# EAGLE schematic Manipulator_loads (EAGLE 9.4.2)

## Sheet 1 of 2
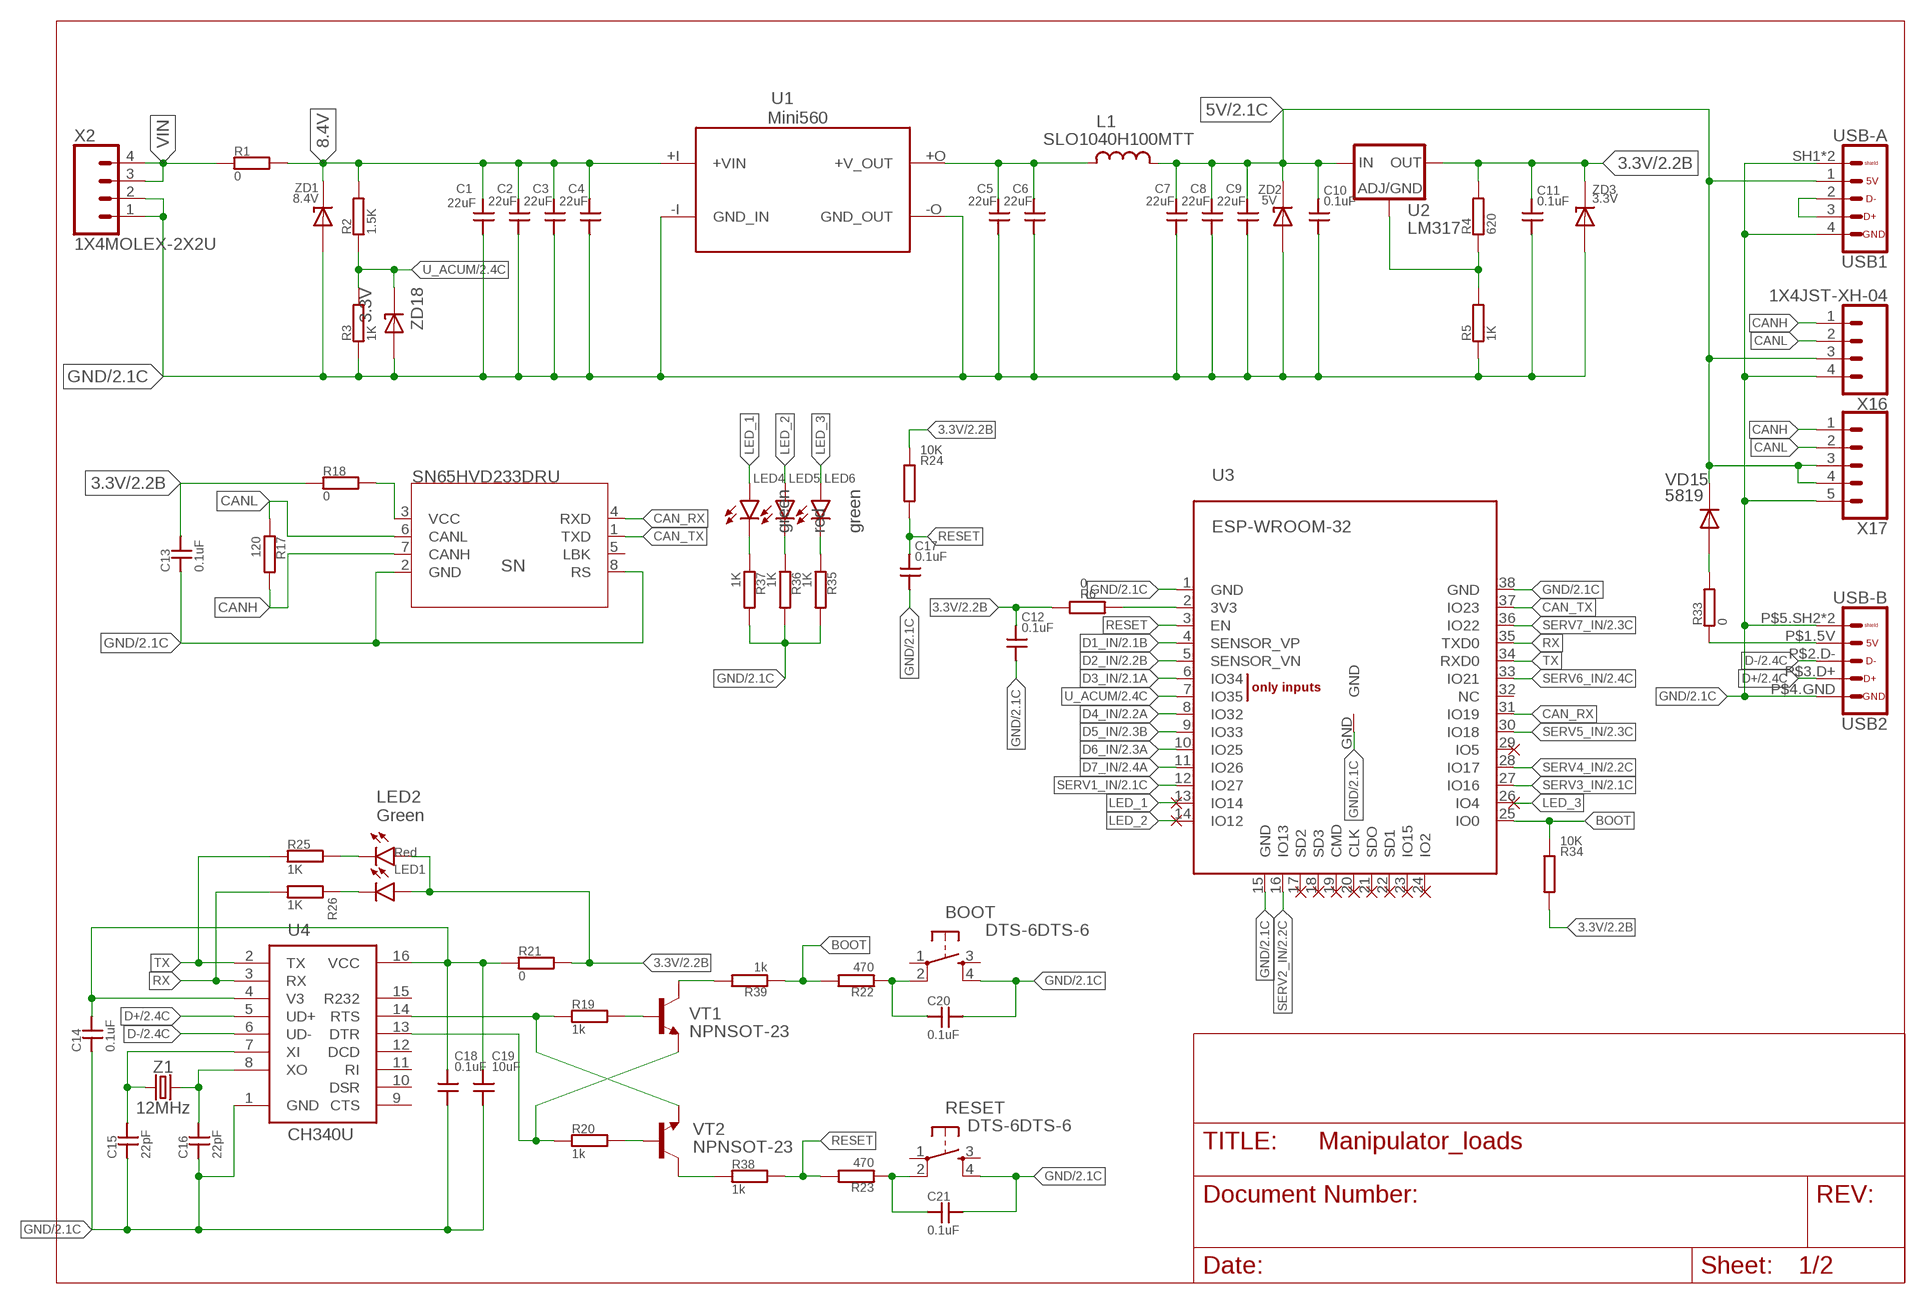
[diagram p0: schematic, sheet 1]

### Parts
BOOT  DTS-6DTS-6  [DTS-6]
C1  22uF  C1206  [1206]
C2  22uF  C1206  [1206]
C3  22uF  C1206  [1206]
C4  22uF  C1206  [1206]
C5  22uF  C1206  [1206]
C6  22uF  C1206  [1206]
C7  22uF  C1206  [1206]
C8  22uF  C1206  [1206]
C9  22uF  C1206  [1206]
C10  0.1uF  C0603  [0603]
C11  0.1uF  C0603  [0603]
C12  0.1uF  C0603  [0603]
C13  0.1uF  C0603  [0603]
C14  0.1uF  C0603  [0603]
C15  22pF  C0603  [0603]
C16  22pF  C0603  [0603]
C17  0.1uF  C0603  [0603]
C18  0.1uF  C0603  [0603]
C19  10uF  C0603  [0603]
C20  0.1uF  C0603  [0603]
C21  0.1uF  C0603  [0603]
L1  SLO1040H100MTT  INDUCTOR108100X400  [108100X400]
LED1  Red  LED1608  [1608]
LED2  Green  LED1608  [1608]
LED4  green  LED1608  [1608]
LED5  red  LED1608  [1608]
LED6  green  LED1608  [1608]
R1  0  R2512  [2512]
R2  1.5K  R0603  [0603]
R3  1K  R0603  [0603]
R4  620  R0603  [0603]
R5  1K  R0603  [0603]
R6  0  R0603  [0603]
R17  120  R0603  [0603]
R18  0  R0603  [0603]
R19  1k  R0603  [0603]
R20  1k  R0603  [0603]
R21  0  R0603  [0603]
R22  470  R0603  [0603]
R23  470  R0603  [0603]
R24  10K  R0603  [0603]
R25  1K  R0603  [0603]
R26  1K  R0603  [0603]
R33  0  R0603  [0603]
R34  10K  R0603  [0603]
R35  1K  R0603  [0603]
R36  1K  R0603  [0603]
R37  1K  R0603  [0603]
R38  1k  R0603  [0603]
R39  1k  R0603  [0603]
RESET  DTS-6DTS-6  [DTS-6]
SN  SN65HVD233DRU  [SOIC-8]
U1  Mini560  MINI560  [MINI560_OTB]
U2  LM317  [D-PAK]
U3  ESP-WROOM-32  [ESP-WROOM-32]
U4  CH340U  [SOIC-16]
USB1  USB-A  [A-VERTICAL]
USB2  USB-B  [B-VERTICAL]
VD15  5819  DIODESOD-123  [SOD123]
VT1  NPNSOT-23  [SOT-23]
VT2  NPNSOT-23  [SOT-23]
X2  1X4MOLEX-2X2U  [MOLEX-2X2U]
X16  1X4JST-XH-04  [JST-XH-04]
X17  1X5JST-XH-05  [JST-XH-05]
Z1  12MHz  CRYSTAL4FOOT  [CRYSTAL-SMD-3.2X2.5MM]
ZD1  8.4V  ZENER-DIODESSMB  [SMB]
ZD2  5V  ZENER-DIODESSMB  [SMB]
ZD3  3.3V  ZENER-DIODESMINIMELF  [MINIMELF]
ZD18  3.3V  ZENER-DIODESMINIMELF  [MINIMELF]

### Nets
3.3V: C11.P$2 C12.P$2 C13.P$2 LED1.P$2(A) LED2.P$2(A) R4.P$2 R6.P$2 R18.P$1 R21.P$2 R24.P$1 R34.P$2 U2.4(OUT) ZD3.C ; also sheet 2
5: C5.P$2 C6.P$2 L1.1 U1.+O(+V_OUT)
5V: C7.P$2 C8.P$2 C9.P$2 C10.P$2 L1.2 U2.3(IN) USB1.1 VD15.C X16.3 X17.3 X17.4 ZD2.C ; also sheet 2
8.4V: C1.P$2 C2.P$2 C3.P$2 C4.P$2 R1.2 R2.P$2 U1.+I(+VIN) ZD1.C
BOOT: R22.P$2 R34.P$1 R39.P$1 U3.25(IO0)
CAN_RX: SN.4(RXD) U3.31(IO19)
CAN_TX: SN.1(TXD) U3.37(IO23)
CANH: R17.P$2 SN.7(CANH) X16.1 X17.1
CANL: R17.P$1 SN.6(CANL) X16.2 X17.2
D1_IN: U3.4(SENSOR_VP) ; also sheet 2
D2_IN: U3.5(SENSOR_VN) ; also sheet 2
D3_IN: U3.6(IO34) ; also sheet 2
D4_IN: U3.8(IO32) ; also sheet 2
D5_IN: U3.9(IO33) ; also sheet 2
D6_IN: U3.10(IO25) ; also sheet 2
D7_IN: U3.11(IO26) ; also sheet 2
D+: U4.5(UD+) USB2.P$3.D+ ; also sheet 2
D-: U4.6(UD-) USB2.P$2.D- ; also sheet 2
DTR: R20.P$1 U4.13(DTR) VT1.2(E)
GND: BOOT.4 C1.P$1 C2.P$1 C3.P$1 C4.P$1 C5.P$1 C6.P$1 C7.P$1 C8.P$1 C9.P$1 C10.P$1 C11.P$1 C12.P$1 C13.P$1 C14.P$1 C15.P$1 C16.P$1 C17.P$1 C18.P$1 C19.P$1 C20.P$2 C21.P$2 R3.P$1 R5.P$1 R35.P$2 R36.P$2 R37.P$2 RESET.4 SN.2(GND) SN.8(RS) U1.-I(GND_IN) U1.-O(GND_OUT) U3.1(GND) U3.15(GND) U3.38(GND) U3.GND U4.1(GND) USB1.4 USB1.SH1(SHIELD) USB1.SH2(SHIELD) USB2.P$4.GND USB2.P$5.SH2(SHIELD) USB2.P$6.SH1(SHIELD) X2.1 X2.2 X16.4 X17.5 ZD1.A ZD2.A ZD3.A ZD18.A ; also sheet 2
LED_1: LED4.P$2(A) U3.13(IO14)
LED_2: LED5.P$2(A) U3.14(IO12)
LED_3: LED6.P$2(A) U3.26(IO4)
N$1: R6.P$1 U3.2(3V3)
N$2: LED2.P$1(C) R25.P$2
N$3: LED1.P$1(C) R26.P$2
N$5: R18.P$2 SN.3(VCC)
N$6: R4.P$1 R5.P$2 U2.1(ADJ/GND)
N$7: LED4.P$1(C) R37.P$1
N$8: LED5.P$1(C) R36.P$1
N$10: USB1.2 USB1.3
N$11: LED6.P$1(C) R35.P$1
N$12: R33.P$1 USB2.P$1.5V
N$15: R33.P$2 VD15.A
N$22: R39.P$2 VT1.3(C)
N$25: R38.P$1 VT2.3(C)
N$30: C16.P$2 U4.8(XO) Z1.3
N$31: C15.P$2 U4.7(XI) Z1.1
N$32: R19.P$2 VT1.1(B)
N$33: R20.P$2 VT2.1(B)
N$34: BOOT.2 C20.P$1 R22.P$1
N$35: C21.P$1 R23.P$1 RESET.2
RESET: C17.P$2 R23.P$2 R24.P$2 R38.P$2 U3.3(EN)
RTS: R19.P$1 U4.14(RTS) VT2.2(E)
RX: R26.P$1 U3.35(TXD0) U4.3(RX)
SERV1_IN: U3.12(IO27) ; also sheet 2
SERV2_IN: U3.16(IO13) ; also sheet 2
SERV3_IN: U3.27(IO16) ; also sheet 2
SERV4_IN: U3.28(IO17) ; also sheet 2
SERV5_IN: U3.30(IO18) ; also sheet 2
SERV6_IN: U3.33(IO21) ; also sheet 2
SERV7_IN: U3.36(IO22) ; also sheet 2
TX: R25.P$1 U3.34(RXD0) U4.2(TX)
U_ACUM: R2.P$1 R3.P$2 U3.7(IO35) ZD18.C ; also sheet 2
VCC: C14.P$2 C18.P$2 C19.P$2 R21.P$1 U4.4(V3) U4.16(VCC)
VIN: R1.1 X2.3 X2.4
Unconnected: BOOT.1 BOOT.3 RESET.1 RESET.3 SN.5(LBK) U3.17(SD2) U3.18(SD3) U3.19(CMD) U3.20(CLK) U3.21(SDO) U3.22(SD1) U3.23(IO15) U3.24(IO2) U3.29(IO5) U3.32(NC) U4.9(CTS) U4.10(DSR) U4.11(RI) U4.12(DCD) U4.15(R232)

## Sheet 2 of 2
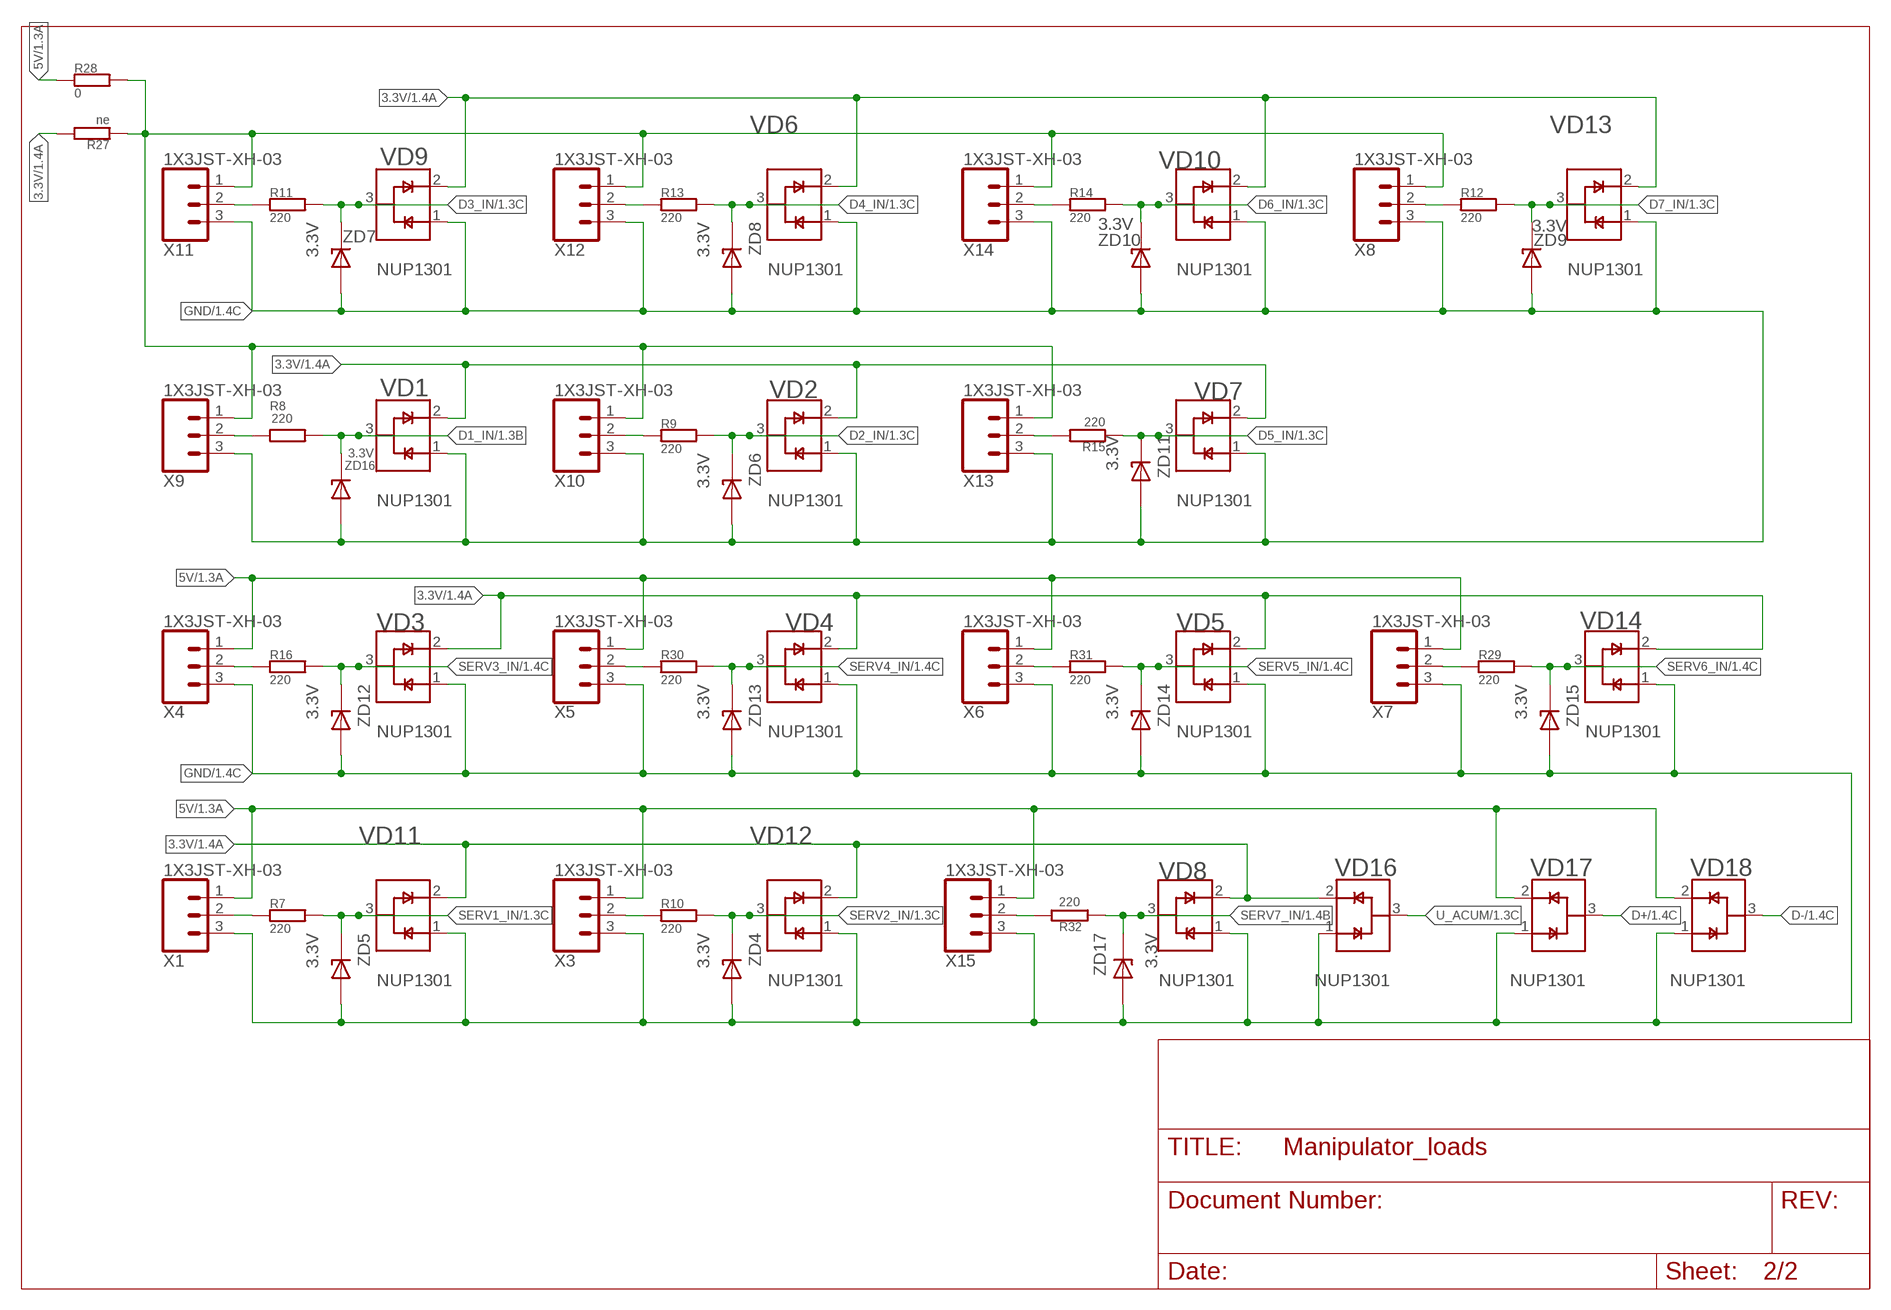
[diagram p1: schematic, sheet 2]

### Parts
R7  220  R0603  [0603]
R8  220  R0603  [0603]
R9  220  R0603  [0603]
R10  220  R0603  [0603]
R11  220  R0603  [0603]
R12  220  R0603  [0603]
R13  220  R0603  [0603]
R14  220  R0603  [0603]
R15  220  R0603  [0603]
R16  220  R0603  [0603]
R27  ne  R0603  [0603]
R28  0  R0603  [0603]
R29  220  R0603  [0603]
R30  220  R0603  [0603]
R31  220  R0603  [0603]
R32  220  R0603  [0603]
VD1  BAV99.215  ESD_PROTECTIONSOT123  [SOT23]
VD2  BAV99.215  ESD_PROTECTIONSOT123  [SOT23]
VD3  BAV99.215  ESD_PROTECTIONSOT123  [SOT23]
VD4  BAV99.215  ESD_PROTECTIONSOT123  [SOT23]
VD5  BAV99.215  ESD_PROTECTIONSOT123  [SOT23]
VD6  BAV99  ESD_PROTECTIONSOT123  [SOT23]
VD7  BAV99.215  ESD_PROTECTIONSOT123  [SOT23]
VD8  BAV99.215  ESD_PROTECTIONSOT123  [SOT23]
VD9  BAV99  ESD_PROTECTIONSOT123  [SOT23]
VD10  BAV99.215  ESD_PROTECTIONSOT123  [SOT23]
VD11  BAV99.215  ESD_PROTECTIONSOT123  [SOT23]
VD12  BAV99.215  ESD_PROTECTIONSOT123  [SOT23]
VD13  BAV99.215  ESD_PROTECTIONSOT123  [SOT23]
VD14  BAV99.215  ESD_PROTECTIONSOT123  [SOT23]
VD16  BAV99.215  ESD_PROTECTIONSOT123  [SOT23]
VD17  BAV99.215  ESD_PROTECTIONSOT123  [SOT23]
VD18  BAV99.215  ESD_PROTECTIONSOT123  [SOT23]
X1  1X3JST-XH-03  [JST-XH-03]
X3  1X3JST-XH-03  [JST-XH-03]
X4  1X3JST-XH-03  [JST-XH-03]
X5  1X3JST-XH-03  [JST-XH-03]
X6  1X3JST-XH-03  [JST-XH-03]
X7  1X3JST-XH-03  [JST-XH-03]
X8  1X3JST-XH-03  [JST-XH-03]
X9  1X3JST-XH-03  [JST-XH-03]
X10  1X3JST-XH-03  [JST-XH-03]
X11  1X3JST-XH-03  [JST-XH-03]
X12  1X3JST-XH-03  [JST-XH-03]
X13  1X3JST-XH-03  [JST-XH-03]
X14  1X3JST-XH-03  [JST-XH-03]
X15  1X3JST-XH-03  [JST-XH-03]
ZD4  3.3V  ZENER-DIODESMINIMELF  [MINIMELF]
ZD5  3.3V  ZENER-DIODESMINIMELF  [MINIMELF]
ZD6  3.3V  ZENER-DIODESMINIMELF  [MINIMELF]
ZD7  3.3V  ZENER-DIODESMINIMELF  [MINIMELF]
ZD8  3.3V  ZENER-DIODESMINIMELF  [MINIMELF]
ZD9  3.3V  ZENER-DIODESMINIMELF  [MINIMELF]
ZD10  3.3V  ZENER-DIODESMINIMELF  [MINIMELF]
ZD11  3.3V  ZENER-DIODESMINIMELF  [MINIMELF]
ZD12  3.3V  ZENER-DIODESMINIMELF  [MINIMELF]
ZD13  3.3V  ZENER-DIODESMINIMELF  [MINIMELF]
ZD14  3.3V  ZENER-DIODESMINIMELF  [MINIMELF]
ZD15  3.3V  ZENER-DIODESMINIMELF  [MINIMELF]
ZD16  3.3V  ZENER-DIODESMINIMELF  [MINIMELF]
ZD17  3.3V  ZENER-DIODESMINIMELF  [MINIMELF]

### Nets
3.3V: R27.P$2 VD1.2(VCC) VD2.2(VCC) VD3.2(VCC) VD4.2(VCC) VD5.2(VCC) VD6.2(VCC) VD7.2(VCC) VD8.2(VCC) VD9.2(VCC) VD10.2(VCC) VD11.2(VCC) VD12.2(VCC) VD13.2(VCC) VD14.2(VCC) VD16.2(VCC) ; also sheet 1
5V: R28.P$1 VD17.2(VCC) VD18.2(VCC) X1.1 X3.1 X4.1 X5.1 X6.1 X7.1 X15.1 ; also sheet 1
D1_IN: R8.P$2 VD1.3(I/O) ZD16.C ; also sheet 1
D1_OUT: R8.P$1 X9.2
D2_IN: R9.P$2 VD2.3(I/O) ZD6.C ; also sheet 1
D3_IN: R11.P$2 VD9.3(I/O) ZD7.C ; also sheet 1
D4_IN: R13.P$2 VD6.3(I/O) ZD8.C ; also sheet 1
D5_IN: R15.P$1 VD7.3(I/O) ZD11.C ; also sheet 1
D6_IN: R14.P$2 VD10.3(I/O) ZD10.C ; also sheet 1
D7_IN: R12.P$2 VD13.3(I/O) ZD9.C ; also sheet 1
D+: VD17.3(I/O) ; also sheet 1
D-: VD18.3(I/O) ; also sheet 1
GND: VD1.1(GND) VD2.1(GND) VD3.1(GND) VD4.1(GND) VD5.1(GND) VD6.1(GND) VD7.1(GND) VD8.1(GND) VD9.1(GND) VD10.1(GND) VD11.1(GND) VD12.1(GND) VD13.1(GND) VD14.1(GND) VD16.1(GND) VD17.1(GND) VD18.1(GND) X1.3 X3.3 X4.3 X5.3 X6.3 X7.3 X8.3 X9.3 X10.3 X11.3 X12.3 X13.3 X14.3 X15.3 ZD4.A ZD5.A ZD6.A ZD7.A ZD8.A ZD9.A ZD10.A ZD11.A ZD12.A ZD13.A ZD14.A ZD15.A ZD16.A ZD17.A ; also sheet 1
N$16: R31.P$1 X6.2
N$17: R15.P$2 X13.2
N$18: R14.P$1 X14.2
N$20: R13.P$1 X12.2
N$21: R27.P$1 R28.P$2 X8.1 X9.1 X10.1 X11.1 X12.1 X13.1 X14.1
N$23: R9.P$1 X10.2
N$24: R11.P$1 X11.2
N$27: R12.P$1 X8.2
N$28: R30.P$1 X5.2
N$41: R7.P$1 X1.2
N$42: R32.P$1 X15.2
N$43: R10.P$1 X3.2
N$44: R29.P$1 X7.2
N$45: R16.P$1 X4.2
SERV1_IN: R7.P$2 VD11.3(I/O) ZD5.C ; also sheet 1
SERV2_IN: R10.P$2 VD12.3(I/O) ZD4.C ; also sheet 1
SERV3_IN: R16.P$2 VD3.3(I/O) ZD12.C ; also sheet 1
SERV4_IN: R30.P$2 VD4.3(I/O) ZD13.C ; also sheet 1
SERV5_IN: R31.P$2 VD5.3(I/O) ZD14.C ; also sheet 1
SERV6_IN: R29.P$2 VD14.3(I/O) ZD15.C ; also sheet 1
SERV7_IN: R32.P$2 VD8.3(I/O) ZD17.C ; also sheet 1
U_ACUM: VD16.3(I/O) ; also sheet 1

## Library data of the parts
BOOT RESET = LARS_409_SWITCH:DTS-6
C1-C21 = LARS_409_R,C,L:C
L1 = LARS_409_INDUCTOR:INDUCTOR
LED1 LED2 LED4-LED6 = LARS_409_LED:LED
R1-R39 = LARS_409_R,C,L:R
SN = LARS_409_MC:SN65HVD233DR
U1 = LARS_409_DC-DC:MINI560
U2 = LARS_409_DC-DC:LM317
U3 = LARS_409_MK:ESP-WROOM-32
U4 = LARS_409_MC:CH340
USB1 = LARS_409_USB:USB-A
USB2 = LARS_409_USB:USB-B
VD1-VD14 VD16-VD18 = LARS_409_DIODE:ESD_PROTECTION
VD15 = LARS_409_DIODE:DIODE
VT1 VT2 = LARS_409_TRANSISTORS:NPN
X1 X3-X15 = LARS_409_CONNECTORS:1X3
X2 X16 = LARS_409_CONNECTORS:1X4
X17 = LARS_409_CONNECTORS:1X5
Z1 = LARS_409_CLOCKS:CRYSTAL
ZD1-ZD18 = LARS_409_DIODE:ZENER-DIODES

## Net classes
0 default: width 0.006 mm